# EAGLE schematic LED (EAGLE 6.6.0)
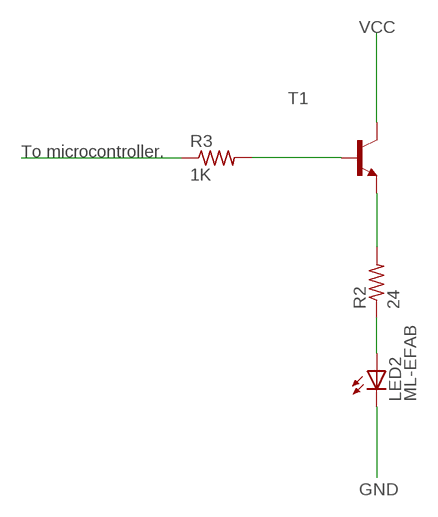
[diagram p0: schematic, sheet 1]

## Parts
LED2  ML-EFAB  [ML-E-FAB]
R2  24  R-US_R1206  [R1206]
R3  1K  R-US_R1206  [R1206]
T1  MMBT3904LT1-NPN-SOT23-BEC  [SOT23-BEC]

## Nets
GND: LED2.C@1(C)
N$1: R2.2 T1.E
N$2: R3.2 T1.B
N$3: LED2.A@1(A) R2.1
N$4: R3.1
VCC: T1.C
Unconnected: LED2.A@2(A) LED2.C@2(C) LED2.TH

## Notes on the sheet
- To microcontroller.

## Library data of the parts
LED2 = LED Light:ML-E: Cree® XLamp® ML-E LEDs 1/2 watt, 3.5 x 3.5 mm Source: Data sheet <http://www.cree.com/products/pdf/XLampML-E.pdf>
R2 R3 = rcl:R-US_: RESISTOR, American symbol
T1 = transistor:*-NPN-: NPN Transistror BF959 corrected 2008.03.06